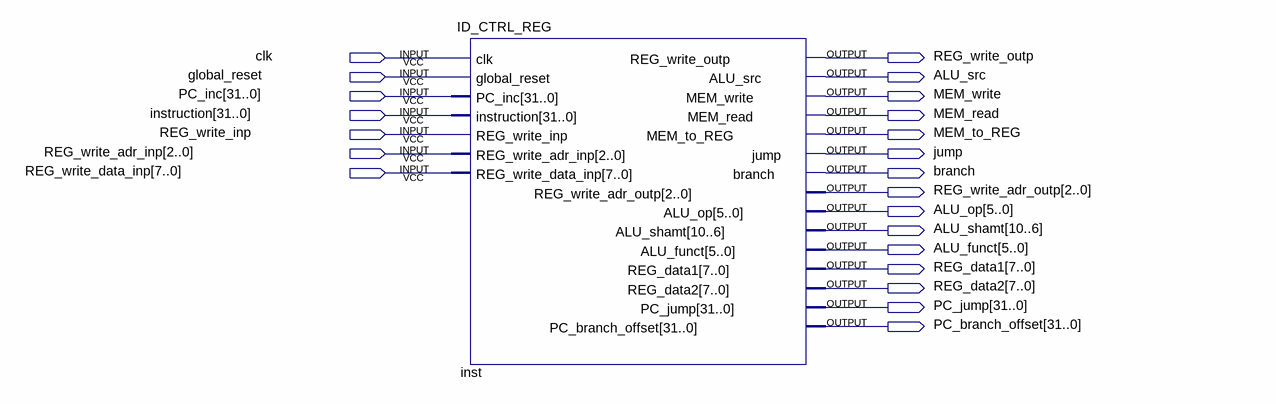
[diagram p0: schematic sheet]
// Quartus schematic ID_CTRL_REG_test.bdf as structural Verilog: 1 symbols, 22 pins
module ID_CTRL_REG_test (
  input  clk,
  input  global_reset,
  input  [31:0] PC_inc,
  input  [31:0] instruction,
  input  REG_write_inp,
  input  [2:0] REG_write_adr_inp,
  input  [7:0] REG_write_data_inp,
  output REG_write_outp,
  output ALU_src,
  output MEM_write,
  output MEM_read,
  output MEM_to_REG,
  output jump,
  output branch,
  output [2:0] REG_write_adr_outp,
  output [5:0] ALU_op,
  output [10:6] ALU_shamt,
  output [5:0] ALU_funct,
  output [7:0] REG_data1,
  output [7:0] REG_data2,
  output [31:0] PC_jump,
  output [31:0] PC_branch_offset
);

  ID_CTRL_REG inst (
    .clk(clk), .global_reset(global_reset), .PC_inc(PC_inc), .instruction(instruction),
    .REG_write_inp(REG_write_inp), .REG_write_adr_inp(REG_write_adr_inp),
    .REG_write_data_inp(REG_write_data_inp), .REG_write_outp(REG_write_outp), .ALU_src(ALU_src),
    .MEM_write(MEM_write), .MEM_read(MEM_read), .MEM_to_REG(MEM_to_REG), .jump(jump), .branch(branch),
    .REG_write_adr_outp(REG_write_adr_outp), .ALU_op(ALU_op), .ALU_shamt(ALU_shamt), .ALU_funct(ALU_funct),
    .REG_data1(REG_data1), .REG_data2(REG_data2), .PC_jump(PC_jump), .PC_branch_offset(PC_branch_offset));
endmodule
